# EAGLE design crow (EAGLE 7.2.0)
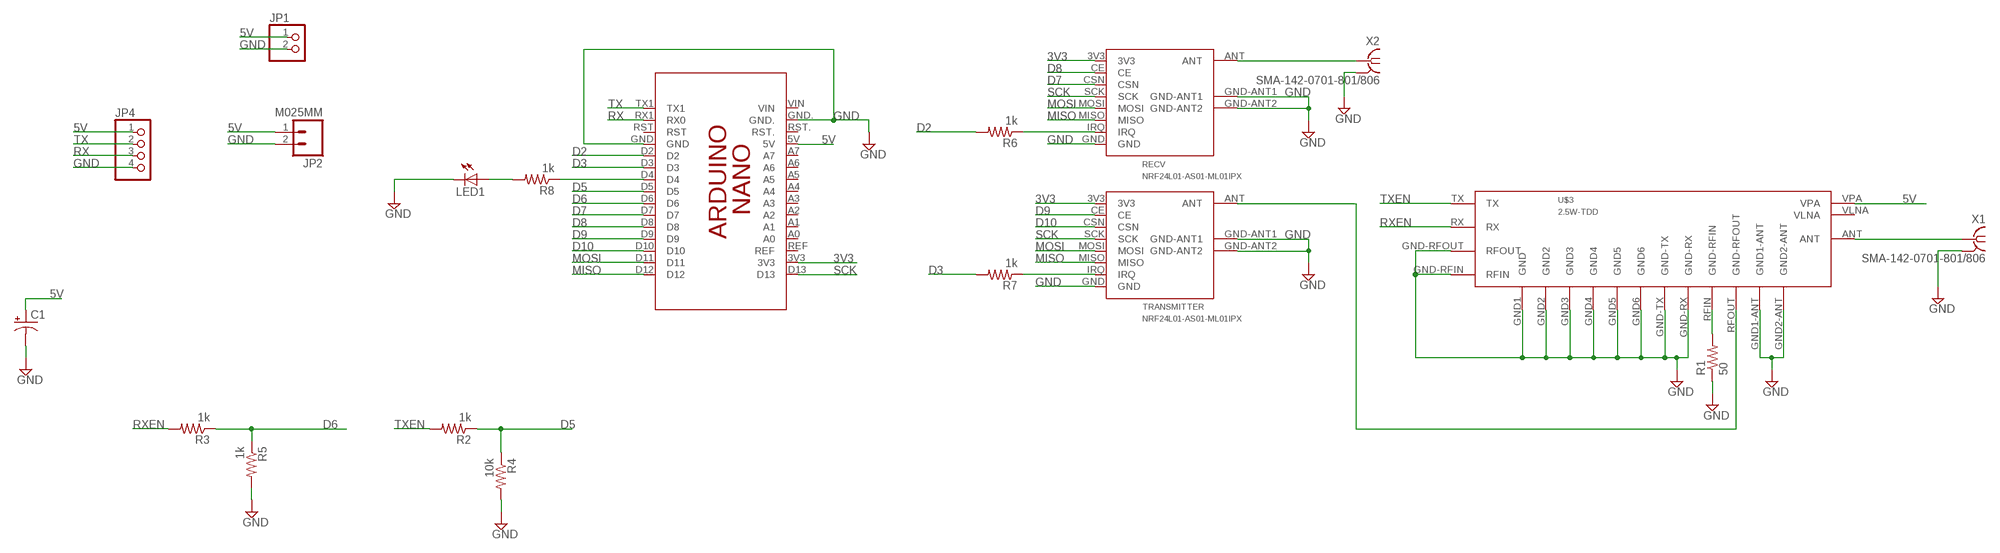
[diagram p0: schematic, sheet 1]

## Parts
C1  CPOL-USUD-5X5,8  [UD-5X5,8_NICHICON]
JP1  PINHD-1X2  [1X02]
JP2  M025MM  [SCREWTERMINAL-5MM-2]
JP4  PINHD-1X4  [1X04]
LED1  LEDSML0805  [SML0805]
PCB1  ARDUINO_NANO_EXT  [ARDUINO_NANO]
R1  50  R-US_M0805  [M0805]
R2  1k  R-US_M0805  [M0805]
R3  1k  R-US_M0805  [M0805]
R4  10k  R-US_M0805  [M0805]
R5  1k  R-US_M0805  [M0805]
R6  1k  R-US_M0805  [M0805]
R7  1k  R-US_M0805  [M0805]
R8  1k  R-US_M0805  [M0805]
RECV  NRF24L01-AS01-ML01IPX  [AS01-ML01IPX]
TRANSMITTER  NRF24L01-AS01-ML01IPX  [AS01-ML01IPX]
U$3  2.5W-TDD  [2.5W-TDD]
X1  SMA-142-0701-801/806  [J502-ND-142-0701-801/806]
X2  SMA-142-0701-801/806  [J502-ND-142-0701-801/806]

## Nets
3V3: PCB1.3V3 RECV.3V3 TRANSMITTER.3V3
5V: C1.+ JP1.1 JP2.1 JP4.1 PCB1.5V U$3.VPA
D2: PCB1.D2 R6.2
D3: PCB1.D3 R7.2
D5: PCB1.D5 R2.1 R4.1
D6: PCB1.D6 R3.1 R5.1
D7: PCB1.D7 RECV.CSN
D8: PCB1.D8 RECV.CE
D9: PCB1.D9 TRANSMITTER.CE
D10: PCB1.D10 TRANSMITTER.CSN
GND: C1.- JP1.2 JP2.2 JP4.4 LED1.C PCB1.GND PCB1.GND. R1.1 R4.2 R5.2 RECV.GND RECV.GND-ANT1 RECV.GND-ANT2 TRANSMITTER.GND TRANSMITTER.GND-ANT1 TRANSMITTER.GND-ANT2 U$3.GND1(GND) U$3.GND1-ANT U$3.GND2 U$3.GND2-ANT U$3.GND3 U$3.GND4 U$3.GND5 U$3.GND6 U$3.GND-RFIN(RFIN) U$3.GND-RFOUT(RFOUT) U$3.GND-RX U$3.GND-TX X1.G@1 X1.G@2 X1.G@3 X1.G@4 X2.G@1 X2.G@2 X2.G@3 X2.G@4
MISO: PCB1.D12 RECV.MISO TRANSMITTER.MISO
MOSI: PCB1.D11 RECV.MOSI TRANSMITTER.MOSI
N$1: R1.2 U$3.RFIN(GND-RFIN)
N$2: U$3.ANT X1.1
N$3: R7.1 TRANSMITTER.IRQ
N$4: RECV.ANT X2.1
N$5: TRANSMITTER.ANT U$3.RFOUT(GND-RFOUT)
N$6: R6.1 RECV.IRQ
N$7: PCB1.D4 R8.1
N$8: LED1.A R8.2
RX: JP4.3 PCB1.RX1(RX0)
RXEN: R3.2 U$3.RX
SCK: PCB1.D13 RECV.SCK TRANSMITTER.SCK
TX: JP4.2 PCB1.TX1
TXEN: R2.2 U$3.TX
Unconnected: PCB1.A0 PCB1.A1 PCB1.A2 PCB1.A3 PCB1.A4 PCB1.A5 PCB1.A6 PCB1.A7 PCB1.REF PCB1.RST PCB1.RST. PCB1.VIN

## Power pins joined to a net without a drawn wire
VLNA: U$3.VLNA

## Library data of the parts
C1 = rcl:CPOL-US: POLARIZED CAPACITOR, American symbol
JP1 = pinhead:PINHD-1X2: PIN HEADER
JP2 = SparkFun-Connectors:M02: Standard 2-pin 0.1" header. Use with - straight break away headers ( PRT-00116) - right angle break away headers (PRT-00553) - swiss pins (PRT-00743) - machine pins (PRT-00117) - female headers (PRT-00115) Molex polarized connector foot print use with: PRT-08233 with associated crimp pins and housings. 2.54_SCREWTERM for use with PRT-10571. 3.5mm Screw Terminal footprints for PRT-08084 5mm Screw Terminal footprints for use with PRT-08432; STOREFRONT_ID: PRT-08432
JP4 = pinhead:PINHD-1X4: PIN HEADER
LED1 = led:LED: LED OSRAM: - CHIPLED LG R971, LG N971, LY N971, LG Q971, LY Q971, LO R971, LY R971 LH N974, LH R974 LS Q976, LO Q976, LY Q976 LO Q996 - Hyper CHIPLED LW Q18S LB Q993, LB Q99A, LB R99A - SideLED LS A670, LO A670, LY A670, LG A670, LP A670 LB A673, LV A673, LT A673, LW A673 LH A674 LY A675 LS A676, LA A676, LO A676, LY A676, LW A676 LS A679, LY A679, LG A679 - Hyper Micro SIDELED® LS Y876, LA Y876, LO Y876, LY Y876 LT Y87S - SmartLED LW L88C, LW L88S LB L89C, LB L89S, LG L890 LS L89K, LO L89K, LY L89K LS L896, LA L896, LO L896, LY L896 - TOPLED LS T670, LO T670, LY T670, LG T670, LP T670 LSG T670, LSP T670, LSY T670, LOP T670, LYG T670 LG T671, LOG T671, LSG T671 LB T673, LV T673, LT T673, LW T673 LH T674 LS T676, LA T676, LO T676, LY T676, LB T676, LH T676, LSB T676, LW T676 LB T67C, LV T67C, LT T67C, LS T67K, LO T67K, LY T67K, LW E67C LS E67B, LA E67B, LO E67B, LY E67B, LB E67C, LV E67C, LT E67C LW T67C LS T679, LY T679, LG T679 LS T770, LO T770, LY T770, LG T770, LP T770 LB T773, LV T773, LT T773, LW T773 LH T774 LS E675, LA E675, LY E675, LS T675 LS T776, LA T776, LO T776, LY T776, LB T776 LHGB T686 LT T68C, LB T68C - Hyper Mini TOPLED® LB M676 - Mini TOPLED Santana® LG M470 LS M47K, LO M47K, LY M47K Source: http://www.osram.convergy.de LUXEON: - LUMILED® LXK2-PW12-R00, LXK2-PW12-S00, LXK2-PW14-U00, LXK2-PW14-V00 LXK2-PM12-R00, LXK2-PM12-S00, LXK2-PM14-U00 LXK2-PE12-Q00, LXK2-PE12-R00, LXK2-PE12-S00, LXK2-PE14-T00, LXK2-PE14-U00 LXK2-PB12-K00, LXK2-PB12-L00, LXK2-PB12-M00, LXK2-PB14-N00, LXK2-PB14-P00, LXK2-PB14-Q00 LXK2-PR12-L00, LXK2-PR12-M00, LXK2-PR14-Q00, LXK2-PR14-R00 LXK2-PD12-Q00, LXK2-PD12-R00, LXK2-PD12-S00 LXK2-PH12-R00, LXK2-PH12-S00 LXK2-PL12-P00, LXK2-PL12-Q00, LXK2-PL12-R00 Source: www.luxeon.com KINGBRIGHT: KA-3528ASYC Source: www.kingbright.com
PCB1 = hqc-avr:ARDUINO_NANO_EXT: Device for representing an Arduino Nano board in an EAGLE design without the PCB footprint. Created by Dave Young for Element14. More EAGLE documentation at: http://www.element14.com/community/community/knode/cadsoft_eagle
R1-R8 = rcl:R-US_: RESISTOR, American symbol
RECV TRANSMITTER = hqc-communication:NRF24L01-AS01-ML01IPX
U$3 = hqc-communication:2.5W-TDD
X1 X2 = con-coax:SMA-: SMA 50 Ohm End Launch Jack Receptacle - Round Contact Johnson Components Source: www.johnsoncomponents.com .. J502-ND.pdf; MF: JOHNSON COMPONENTS; MPN: 142-0701-801; OC_FARNELL: 1608592; OC_NEWARK: 90F2624

## Board
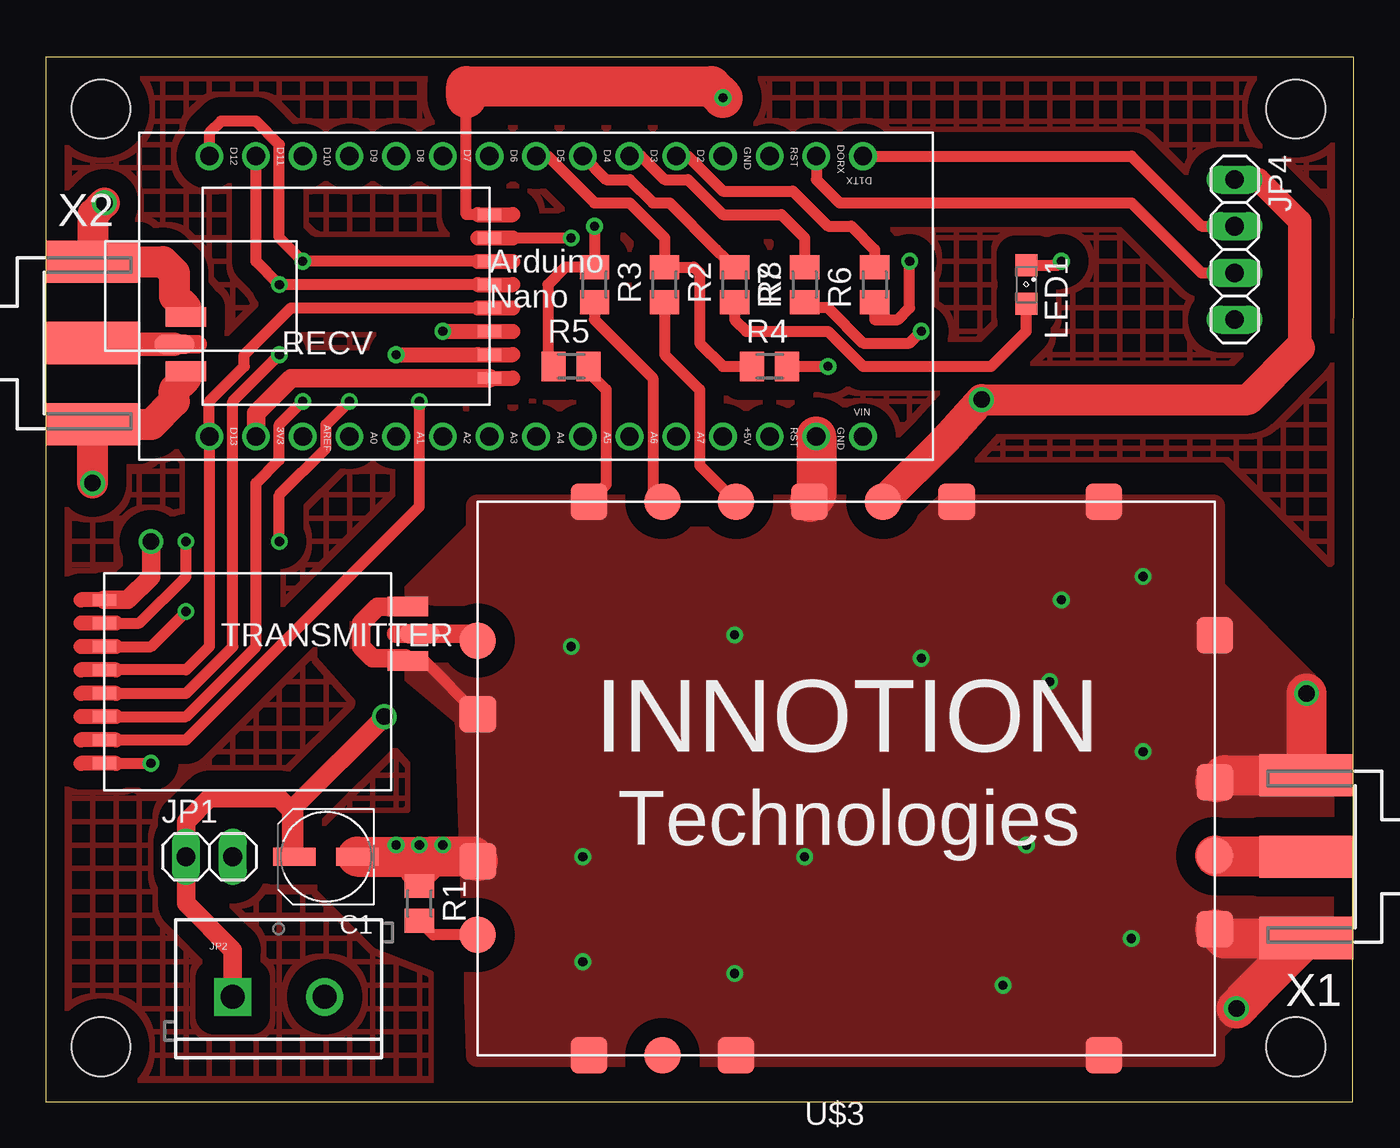
[diagram p1: board, top side]
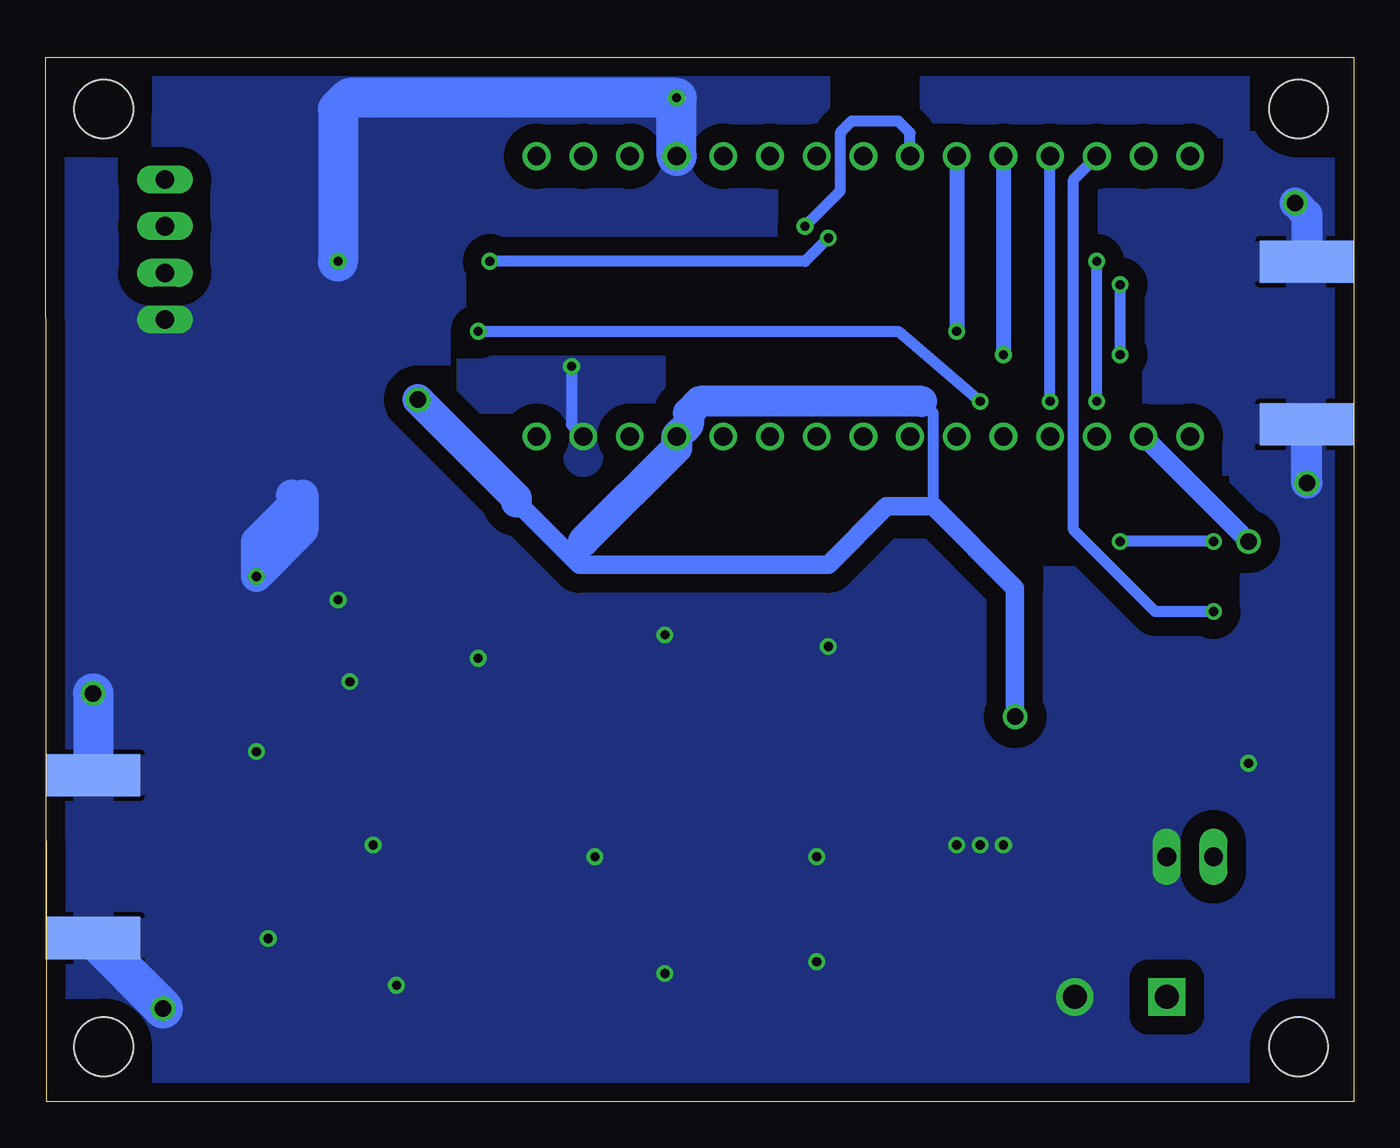
[diagram p2: board, bottom side, seen from below]

Size 71.14 x 56.82 mm. Coordinates in mm from the lower left corner, seen from the top.
Outline: 0,0 71.1,0 71.14,56.82 0,56.82 0,0
Copper layers (1*16): Top 0.035mm / dielectric 1.5mm / Bottom 0.035mm
Design rules "default *": minimum track width 10mil, minimum drill 0.3mm, track to track 6mil, track to pad 6mil, pad to pad 6mil, via to via 6mil, smd to smd 8mil, copper to edge 40mil, drill to drill 8mil, minimum pad ring 10mil, minimum via ring 8mil, stop-mask expansion 4mil, vias tented up to drill 1mm, thermal gap 10mil
Holes 3.2 mm at 3,3 68,3 68,54 3,54

### Footprints (pad centres in the part's own frame; a part is rotated, then mirrored left to right if it is on the bottom)
UD-5X5,8_NICHICON = smd 2.3 x 1: + 1.725,0; - -1.7,0
1X02 = drill 1.016 long: 1 -1.27,0; 2 1.27,0
SCREWTERMINAL-5MM-2 = drill 1.3 pad 2.032 square: 1 0,0 | drill 1.3 pad 2.032: 2 5,0
1X04 = drill 1.016 long: 1 -3.81,0; 2 -1.27,0; 3 1.27,0; 4 3.81,0
SML0805 = smd 1.2 x 1.2: A 1.05,0; C -1.05,0
ARDUINO_NANO = drill 1 pad 1.27: 3V3 -13.97,-7.62; 5V 11.43,-7.62; A0 -8.89,-7.62; A1 -6.35,-7.62; A2 -3.81,-7.62; A3 -1.27,-7.62; A4 1.27,-7.62; A5 3.81,-7.62; A6 6.35,-7.62; A7 8.89,-7.62; D2 8.89,7.62; D3 6.35,7.62; D4 3.81,7.62; D5 1.27,7.62; D6 -1.27,7.62; D7 -3.81,7.62; D8 -6.35,7.62; D9 -8.89,7.62; D10 -11.43,7.62; D11 -13.97,7.62; D12 -16.51,7.62; D13 -16.51,-7.62; GND 11.43,7.62; GND. 16.51,-7.62; REF -11.43,-7.62; RST 13.97,7.62; RST. 13.97,-7.62; RX1 16.51,7.62; TX1 19.05,7.62; VIN 19.05,-7.62
M0805 = smd 1.3 x 1.6: 1 -0.95,0; 2 0.95,0
AS01-ML01IPX = smd 1.27 x 0.635: 3V3 0,8.89; CE 0,7.62; CSN 0,6.35; GND 0,0; IRQ 0,1.27; MISO 0,2.54; MOSI 0,3.81; SCK 0,5.08 | smd 2.184 x 1.067: ANT 17.145,7.045; GND-ANT1 16.51,8.52; GND-ANT2 16.51,5.57
2.5W-TDD = smd 2 x 2: ANT 40.1,10.85; GND1 26.05,30.1; GND1-ANT 40.1,14.85; GND2 34.05,30.1; GND2-ANT 40.1,6.85; GND3 40.1,22.85; GND4 34.05,0; GND5 14.05,0; GND6 6.05,0; GND-RFIN 0,10.55; GND-RFOUT 0,18.55; GND-RX 6.05,30.1; GND-TX 18.05,30.1; RFIN 0,6.55; RFOUT 0,22.55; RX 10.05,30.1; TX 14.05,30.1; VLNA 10.05,0; VPA 22.05,30.1
J502-ND-142-0701-801/806 = smd 5.08 x 2.286: 1 2.565,0; G@1 2.565,4.42; G@2 2.565,-4.42 | smd 5.08 x 2.286 bottom: G@3 2.565,4.42; G@4 2.565,-4.42

### Placement (x,y rotation side)
C1  15.24,13.34 180 top
JP1  8.89,13.34 0 top
JP2  10.16,5.71 0 top
JP4  64.67,46.35 270 top
LED1  53.34,44.45 270 top
PCB1  25.4,43.81 0 top
R1  20.32,10.79 270 top
R2  33.66,44.45 270 top
R3  29.84,44.45 270 top
R4  39.37,40.01 0 top
R5  28.57,40.01 0 top
R6  45.09,44.45 90 top
R7  41.27,44.45 90 top
R8  37.47,44.45 270 top
RECV  24.13,48.26 180 top
TRANSMITTER  3.17,18.41 0 top
U$3  23.5,2.54 0 top
X1  71.12,13.34 180 top
X2  0,41.27 0 top

### Tracks (layer width: path | path; a pad name or v marks a point on that pad's centre or on a via)
3V3  (via drill 0.9)
  Top 1.016: PCB1.3V3 11.43,37.47 13.34,39.37 RECV.3V3 | TRANSMITTER.3V3 4.45,27.3 5.71,28.57 v5.71,30.48
  Bottom 1.016: v5.71,30.48 PCB1.3V3
5V  (via drill 0.9)
  Top 1.016: JP2.1 10.16,8.26 7.62,10.79 JP1.1 7.62,15.24 8.89,16.51 12.7,16.51 13.34,15.88 13.34,13.52 C1.+ 13.52,16.05 v18.41,20.95
  Top 1.27: 68.22,41.01 68.22,47.9 65.94,50.16 JP4.1
  Top 1.676: U$3.VPA 48.9,35.99 v50.9,38.2 65.41,38.2 68.22,41.01
  Bottom 0.61: 22.86,32.38 22.86,37.47 23.5,38.1
  Bottom 1.016: v18.41,20.95 18.41,27.94 22.86,32.38 25.4,32.38 28.57,29.21 42.12,29.21 U$3.VPA
  Bottom 1.676: U$3.VPA 45.55,32.84 v50.9,38.2 | 41.91,30.48 36.83,35.56 PCB1.5V 36.2,36.83 36.2,37.47 35.56,38.1 23.5,38.1
D2
  Top 0.61: PCB1.D2 34.92,51.44 36.83,49.53 40.64,49.53 42.55,47.62 43.81,47.62 45.09,46.35 R6.2
D3
  Top 0.61: PCB1.D3 32.38,51.44 33.66,50.16 34.92,50.16 36.83,48.26 40.01,48.26 41.27,46.99 R7.2
D5
  Top 0.61: PCB1.D5 27.3,51.44 29.84,48.9 31.75,48.9 33.66,46.99 R2.1 35.24,45.4 35.56,45.09 35.56,41.27 36.83,40.01 R4.1
D6  (via drill 0.5)
  Top 0.61: v29.84,47.62 R3.1 28.25,45.4 27.3,44.45 27.3,40.33 R5.1
  Bottom 0.61: PCB1.D6 24.13,52.7 24.77,53.34 27.3,53.34 27.94,52.7 27.94,49.53 v29.84,47.62
D7  (via drill 0.5)
  Top 0.813: v21.59,41.91 RECV.CSN
  Bottom 0.813: PCB1.D7 v21.59,41.91
D8  (via drill 0.5)
  Top 0.813: v19.05,40.64 RECV.CE
  Bottom 0.813: PCB1.D8 v19.05,40.64
D9  (via drill 0.5)
  Top 0.61: TRANSMITTER.CE 5.08,26.04 7.62,28.57 v7.62,30.48 | v12.7,30.48 12.7,33.02 15.24,35.56 15.24,36.83 v16.51,38.1
  Bottom 0.61: v7.62,30.48 v12.7,30.48 | v16.51,38.1 PCB1.D9
D10  (via drill 0.5)
  Top 0.61: TRANSMITTER.CSN 5.71,24.77 v7.62,26.67
  Bottom 0.61: v7.62,26.67 10.79,26.67 15.24,31.11 15.24,50.16 PCB1.D10
GND  (via drill 0.5, 0.5 pad 0.3, 0.9)
  Top 0.61: LED1.C 55.02,45.5 v55.24,45.72 | R1.1 20.32,13.34 | TRANSMITTER.GND v5.71,18.41 | TRANSMITTER.GND-ANT2 20.6,23.98 U$3.GND-RFOUT | R4.2 v42.55,40.01 | RECV.GND 22.86,48.26 22.86,54.61 | RECV.GND-ANT1 7.62,39.37 | 7.62,43.18 RECV.GND-ANT2 7.62,42.55 | R5.2 29.52,39.69 30.48,38.73 30.48,33.58 U$3.GND-RX
  Top 1.016: TRANSMITTER.GND-ANT1 18.05,26.93 17.14,26.04 17.14,24.77 17.78,24.13 19.54,24.13 TRANSMITTER.GND-ANT2
  Top 1.676: 7.62,43.18 6.99,43.81 6.99,45.09 6.38,45.7 X2.G@3 2.56,48.28 v3.17,48.9 | 7.62,39.37 6.99,38.73 6.99,38.1 5.74,36.85 X2.G@4 2.54,36.83 v2.54,33.66
  Top 2.184: v64.77,5.08 66.02,6.38 X1.G@3 68.53,8.89 64.14,8.89 63.63,9.39 U$3.GND2-ANT | v68.58,22.23 68.58,17.78 X1.G@4 68.53,17.78 64.14,17.78 63.74,17.39 U$3.GND1-ANT | C1.- 20.32,13.34 20.95,13.34 | U$3.GND-RFIN 23.25,13.34 20.95,13.34 | 20.95,13.34 20.32,12.7 | PCB1.GND. 41.91,33.01 U$3.GND-TX | 22.86,54.61 22.86,55.24 36.2,55.24 v36.83,54.61
  Bottom 0.61: v42.55,40.01 42.55,36.83 PCB1.GND.
  Bottom 1.676: v3.17,48.9 2.54,48.26 2.54,45.72 X2.G@3 | X2.G@4 2.56,33.68 v2.54,33.66 | 57.78,32.38 57.15,33.02 57.15,31.11 v59.69,28.57 59.69,30.48 57.78,32.38 | 57.78,33.02 57.78,32.38
  Bottom 2.184: v64.77,5.08 68.58,8.89 X1.G@3 | X1.G@4 68.56,22.2 v68.58,22.23 | PCB1.GND v36.83,54.61 54.61,54.61 55.24,53.98 v55.24,45.72
  other vias: 19.05,13.97 20.32,13.97 21.59,13.97 59.05,8.89 52.07,6.35 37.47,6.99 59.69,19.05 53.34,13.97 41.27,13.34 29.21,13.34 29.21,7.62 28.57,24.77 37.47,25.4 47.62,24.13 54.61,22.86 55.24,27.3
  pour Bottom (isolate 1.016): 0,56.52 0,0 71.12,0 71.12,56.52
  pour Top (isolate 1.016, no thermals): 23.5,32.38 23.5,31.11 19.68,27.3 18.41,27.3 17.14,26.04 17.14,24.77 17.78,24.13 19.05,24.13 22.86,20.95 23.5,2.54 63.5,2.54 63.5,3.81 68.58,8.89 70.48,8.89 70.48,16.51 68.58,18.41 68.58,22.86 63.5,27.94 63.5,32.38
MISO  (via drill 0.5)
  Top 0.61: TRANSMITTER.MISO 7.62,20.95 11.43,24.77 11.43,33.66 12.7,34.92 12.7,36.83 v13.97,38.1 | PCB1.D12 8.89,52.7 9.53,53.34 11.43,53.34 12.7,52.07 12.7,46.99 v13.97,45.72 RECV.MISO
  Bottom 0.61: v13.97,38.1 v13.97,45.72
MOSI  (via drill 0.5)
  Top 0.61: TRANSMITTER.MOSI 7.62,22.23 10.16,24.77 10.16,38.1 v12.7,40.64 | PCB1.D11 11.43,45.72 v12.7,44.45 RECV.MOSI
  Bottom 0.61: v12.7,40.64 v12.7,44.45
N$1
  Top 0.61: U$3.RFIN 21.07,9.09 R1.2
N$2
  Top 2.184: X1.1 63.65,13.34 U$3.ANT
N$3  (via drill 0.5)
  Top 0.61: TRANSMITTER.IRQ 7.62,19.68 20.32,32.38 v20.32,38.1 | R7.1 41.59,43.18 42.55,43.18 44.45,41.27 46.99,41.27 v47.62,41.91
  Bottom 0.61: v47.62,41.91 24.77,41.91 v20.32,38.1
N$4
  Top 1.27: RECV.ANT 2.62,41.22 X2.1
N$5
  Top 1.016: TRANSMITTER.ANT 23.12,25.46 U$3.RFOUT
N$6  (via drill 0.5)
  Top 0.61: RECV.IRQ v28.57,46.99 | R6.1 45.09,42.55 46.35,42.55 46.99,43.18 v46.99,45.72
  Bottom 0.61: v28.57,46.99 29.84,45.72 v46.99,45.72
N$7
  Top 0.61: PCB1.D4 30.48,50.16 31.75,50.16 33.02,48.9 33.92,48.9 36.47,46.35 R8.1
N$8
  Top 0.61: R8.2 37.47,42.55 38.1,41.91 42.55,41.91 44.45,40.01 51.44,40.01 53.34,41.91 LED1.A
N$9
  pour Top (isolate 1.016, hatched): 0,0 20.95,0 20.95,6.99 17.78,8.26 14.61,11.43 14.61,14.61 15.88,15.88 19.68,15.88 19.68,18.41 14.61,24.13 14.61,28.57 20.95,34.92 64.14,34.92 69.85,29.21 71.12,30.48 71.12,56.52 0,56.52
RX
  Top 0.61: PCB1.RX1 41.91,50.16 43.18,48.9 59.05,48.9 62.87,45.09 JP4.3
RXEN
  Top 0.61: R3.2 29.84,42.55 33.02,39.37 33.02,33.16 U$3.RX
SCK
  Top 0.61: TRANSMITTER.SCK 7.62,23.5 8.89,24.77 PCB1.D13 8.89,38.1 10.79,40.01 10.79,40.64 13.34,43.18 RECV.SCK
TX
  Top 0.61: PCB1.TX1 59.05,51.44 62.87,47.62 JP4.2
TXEN
  Top 0.61: U$3.TX 35.56,34.62 35.56,38.73 33.66,40.64 R2.2